# Altium project BiDirectional-Charger-INVERTER-Hardware.PrjPcb
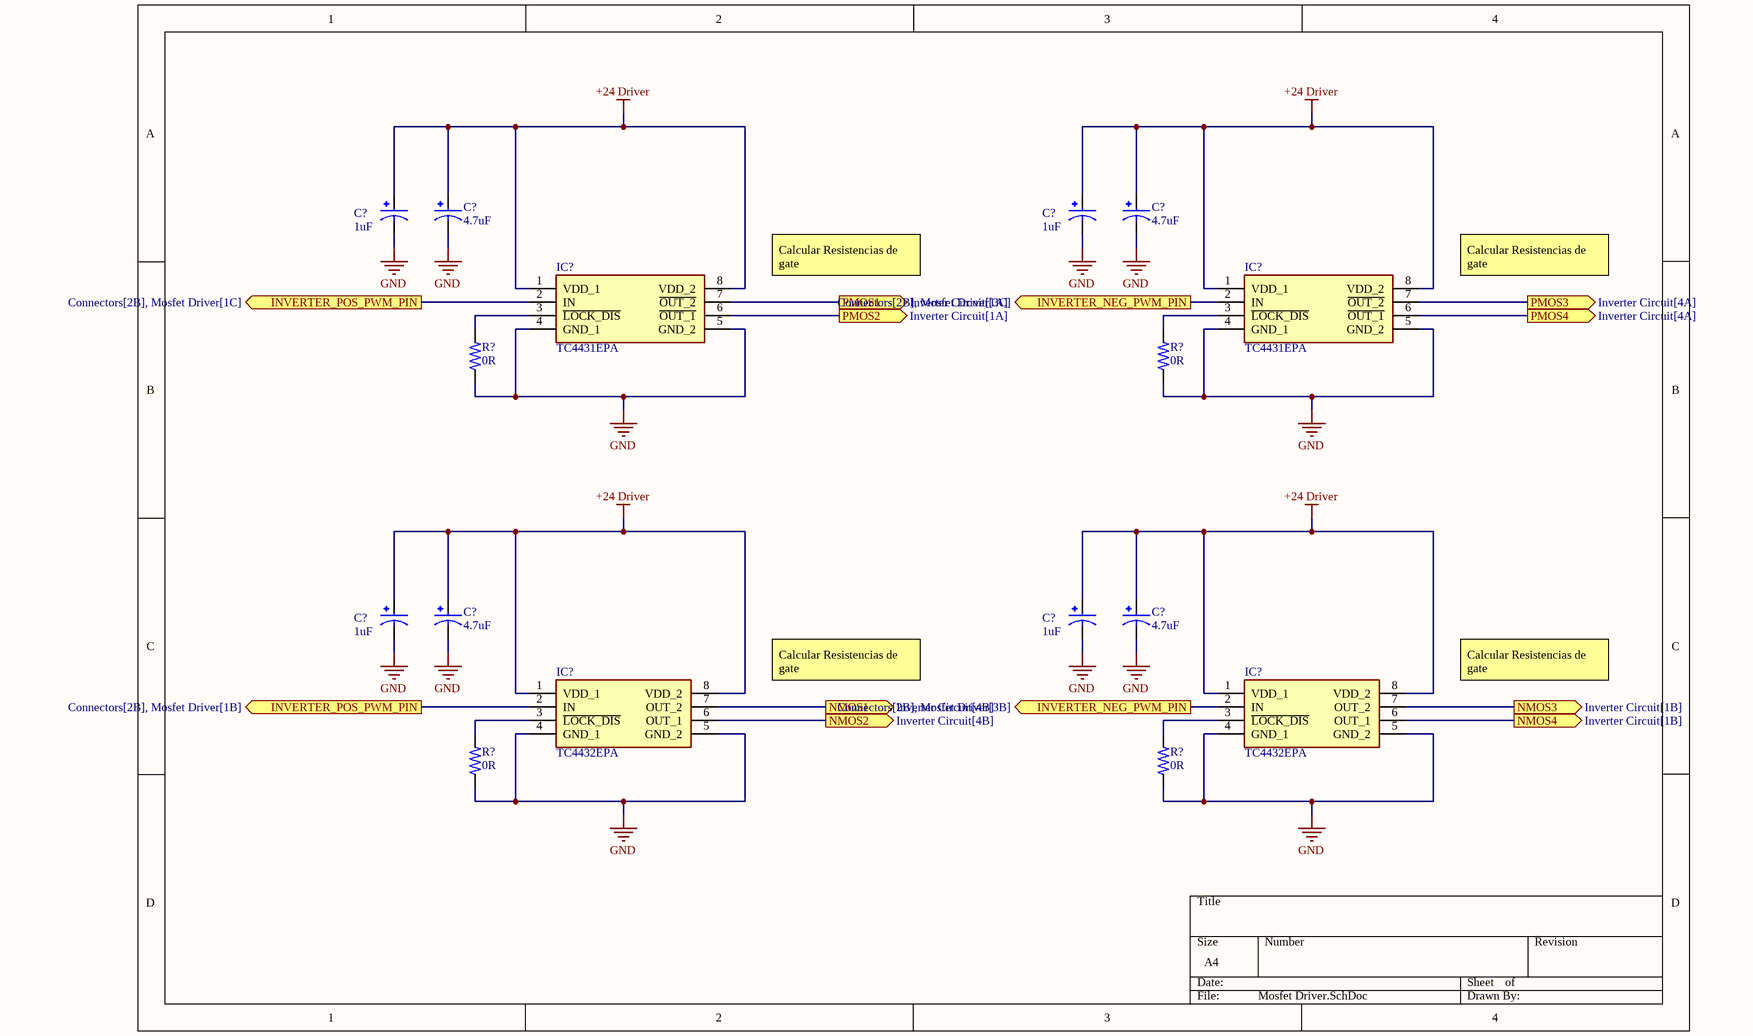
[diagram p0: Mosfet Driver.SchDoc]
4 sheets, 53 parts. Net scope: flat (ports and power ports of the same name join across sheets).
Sheets:
  Mosfet Driver.SchDoc
  Inverter Circuit.SchDoc
  Zero Cross Circuit.SchDoc
  Connectors.SchDoc

## Sheet Mosfet Driver.SchDoc
size A4; SheetNumber: 1; SheetTotal: 3

### Parts
(Parts that share a designator on the sheet are numbered #1, #2 ... from top to bottom, then left to right.)
C?#1  1uF  [Electrolytic 4x5.4]
C?#2  4.7uF  [Electrolytic 4x5.4]
C?#3  1uF  [Electrolytic 4x5.4]
C?#4  4.7uF  [Electrolytic 4x5.4]
C?#5  1uF  [Electrolytic 4x5.4]
C?#6  4.7uF  [Electrolytic 4x5.4]
C?#7  1uF  [Electrolytic 4x5.4]
C?#8  4.7uF  [Electrolytic 4x5.4]
IC?#1  TC4431EPA  [DIP781W56P254L950H533Q8N]
IC?#2  TC4431EPA  [DIP781W56P254L950H533Q8N]
IC?#3  TC4432EPA  [DIP781W56P254L950H533Q8N]
IC?#4  TC4432EPA  [DIP781W56P254L950H533Q8N]
R?#1  0R  [0805]
R?#2  0R  [0805]
R?#3  0R  [0805]
R?#4  0R  [0805]

### Ports
INVERTER_NEG_PWM_PIN (out, see Connectors[2B], Mosfet Driver[3B]), INVERTER_NEG_PWM_PIN (out, see Connectors[2B], Mosfet Driver[3C]), INVERTER_POS_PWM_PIN (out, see Connectors[2B], Mosfet Driver[1B]), INVERTER_POS_PWM_PIN (out, see Connectors[2B], Mosfet Driver[1C]), NMOS1 (out, see Inverter Circuit[4B]), NMOS2 (out, see Inverter Circuit[4B]), NMOS3 (out, see Inverter Circuit[1B]), NMOS4 (out, see Inverter Circuit[1B]), PMOS1 (out, see Inverter Circuit[1A]), PMOS2 (out, see Inverter Circuit[1A]), PMOS3 (out, see Inverter Circuit[4A]), PMOS4 (out, see Inverter Circuit[4A])

### Nets
+24 Driver: C?#1.1 C?#2.1 C?#3.1 C?#4.1 C?#5.1 C?#6.1 C?#7.1 C?#8.1 IC?#1.1(VDD_1) IC?#1.8(VDD_2) IC?#2.1(VDD_1) IC?#2.8(VDD_2) IC?#3.1(VDD_1) IC?#3.8(VDD_2) IC?#4.1(VDD_1) IC?#4.8(VDD_2)
GND: C?#1.2 C?#2.2 C?#3.2 C?#4.2 C?#5.2 C?#6.2 C?#7.2 C?#8.2 IC?#1.4(GND_1) IC?#1.5(GND_2) IC?#2.4(GND_1) IC?#2.5(GND_2) IC?#3.4(GND_1) IC?#3.5(GND_2) IC?#4.4(GND_1) IC?#4.5(GND_2) R?#1.1 R?#2.1 R?#3.1 R?#4.1
NetIC?#1_2: IC?#1.2(IN) IC?#3.2(IN) ; port INVERTER_POS_PWM_PIN
NetIC?#1_3: IC?#1.3(~{LOCK_DIS}) R?#1.2
NetIC?#1_6: IC?#1.6(~{OUT_1}) ; port PMOS2
NetIC?#1_7: IC?#1.7(~{OUT_2}) ; port PMOS1
NetIC?#2_2: IC?#2.2(IN) IC?#4.2(IN) ; port INVERTER_NEG_PWM_PIN
NetIC?#2_3: IC?#2.3(~{LOCK_DIS}) R?#2.2
NetIC?#2_6: IC?#2.6(~{OUT_1}) ; port PMOS4
NetIC?#2_7: IC?#2.7(~{OUT_2}) ; port PMOS3
NetIC?#3_3: IC?#3.3(~{LOCK_DIS}) R?#3.2
NetIC?#3_6: IC?#3.6(OUT_1) ; port NMOS2
NetIC?#3_7: IC?#3.7(OUT_2) ; port NMOS1
NetIC?#4_3: IC?#4.3(~{LOCK_DIS}) R?#4.2
NetIC?#4_6: IC?#4.6(OUT_1) ; port NMOS4
NetIC?#4_7: IC?#4.7(OUT_2) ; port NMOS3

### Notes on the sheet
- Calcular Resistencias de gate

### Library data of the parts
C?#1-C?#8 = Electrolytic 4x5.4: MF: Panasonic; MP: EEE-HA1E100WR; Package: RADIAL-2 Panasonic; Check_prices: https://www.snapeda.com/parts/EEE-HA1E100WR/Panasonic/view-part/778519/?ref=eda; Value: *; Price: None; Purchase-URL: https://pricing.snapeda.com/search/part/EEE-HA1E100WR/?ref=eda; SnapEDA_Link: https://www.snapeda.com/parts/EEE-HA1E100WR/Panasonic/view-part/778519/?ref=snap; Availability: In Stock
IC?#1 IC?#2 = TC4431EPA: Integrated Circuit; Manufacturer_Name: Microchip; Datasheet Link: http://www.microchip.com/mymicrochip/filehandler.aspx?ddocname=en011707; Height: 5.334mm; Manufacturer_Part_Number: TC4431EPA; Mouser Part Number: 579-TC4431EPA; Mouser Price/Stock: https://www.mouser.co.uk/ProductDetail/Microchip-Technology/TC4431EPA?qs=6NittM2kKvToa0NDydYeNA%3D%3D; Arrow Part Number: TC4431EPA; Arrow Price/Stock: https://www.arrow.com/en/products/tc4431epa/microchip-technology
IC?#3 IC?#4 = TC4432EPA: Integrated Circuit; Manufacturer_Name: Microchip; Datasheet Link: http://ww1.microchip.com/downloads/en/DeviceDoc/21424d.pdf; Height: 5.334mm; Manufacturer_Part_Number: TC4432EPA; Mouser Part Number: 579-TC4432EPA; Mouser Price/Stock: https://www.mouser.co.uk/ProductDetail/Microchip-Technology-Atmel/TC4432EPA?qs=EkZBwCRGcSv79fL5L3lP6g%3D%3D; Arrow Part Number: TC4432EPA; Arrow Price/Stock: https://www.arrow.com/en/products/tc4432epa/microchip-technology
R?#1-R?#4 = 0805_Resistor: Power_Rating: .25 W; MP: 2-2176053-0; Tolerance: 1%; Resistance: .33; MF: TE Connectivity; Price: None; Availability: In Stock; EU_RoHS_Compliance: Compliant with Exemptions; Package: 0805; Value: *; SnapEDA_Link: https://www.snapeda.com/parts/2-2176053-0/TE+Connectivity/view-part/?ref=snap; Check_prices: https://www.snapeda.com/parts/2-2176053-0/TE+Connectivity/view-part/?ref=eda

## Sheet Inverter Circuit.SchDoc
size A4; SheetNumber: 2; SheetTotal: 3
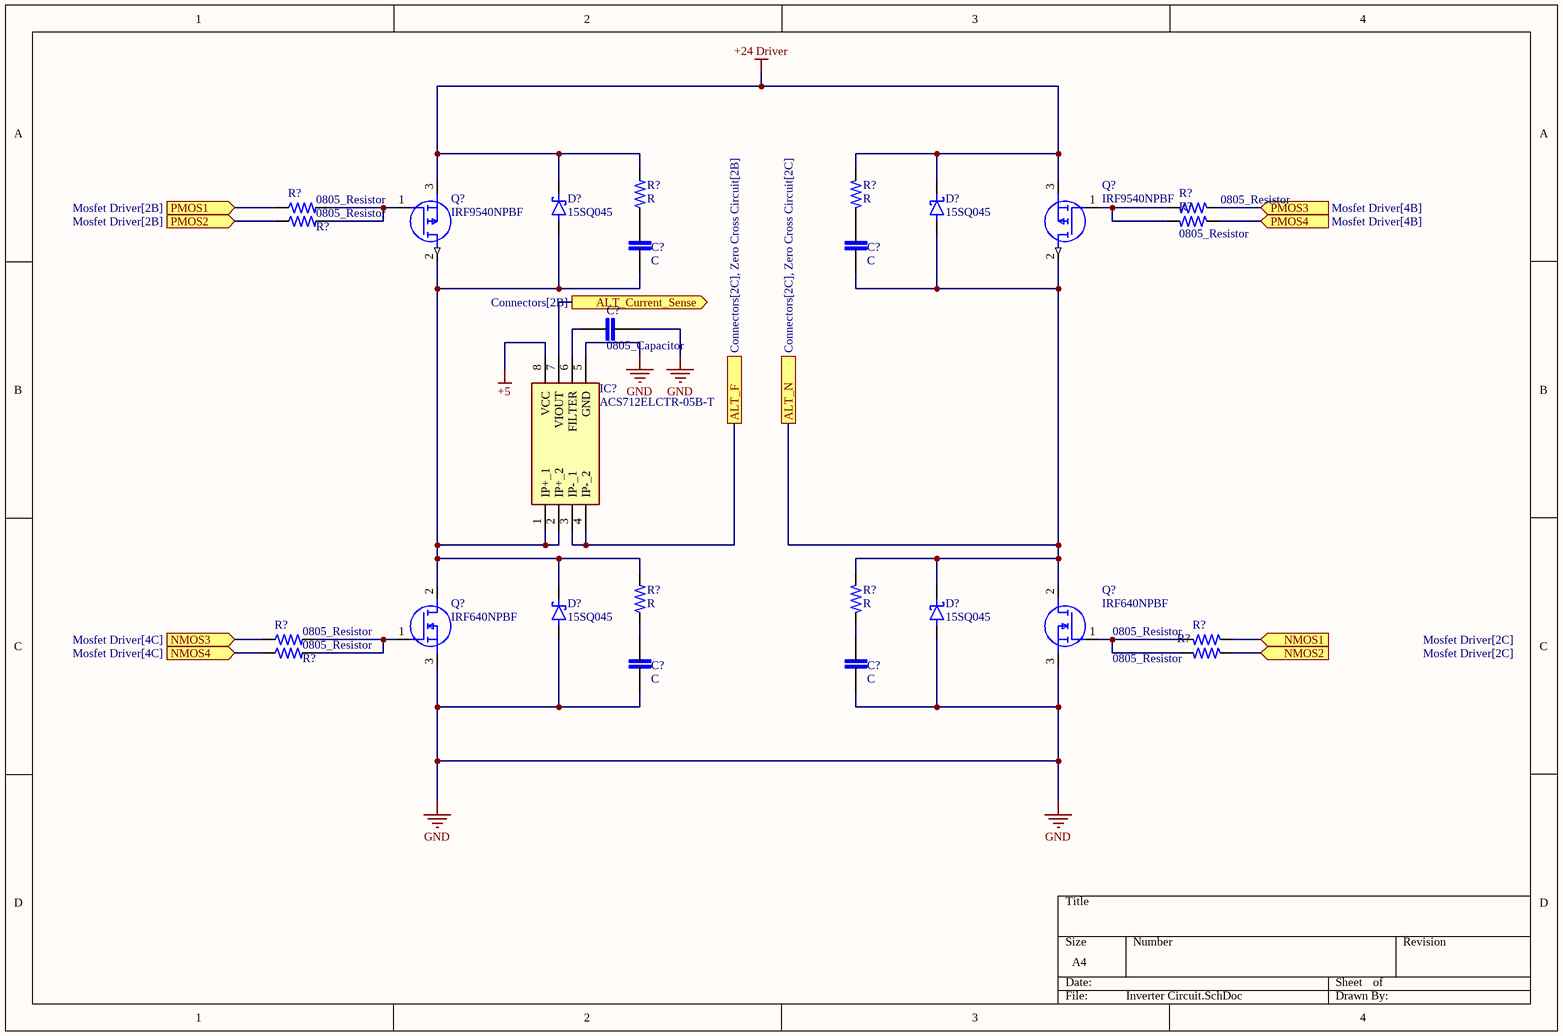
[diagram p1: Inverter Circuit.SchDoc]

### Parts
(Parts that share a designator on the sheet are numbered #1, #2 ... from top to bottom, then left to right.)
C?#9  C  [0805]
C?#10  C  [0805]
C?#11  0805_Capacitor  [0805]
C?#12  C  [0805]
C?#13  C  [0805]
D?#1  15SQ045  [Common Trhough Hole]
D?#2  15SQ045  [Common Trhough Hole]
D?#3  15SQ045  [Common Trhough Hole]
D?#4  15SQ045  [Common Trhough Hole]
IC?#5  ACS712ELCTR-05B-T  [SOIC127P600X175-8N]
Q?#1  IRF9540NPBF  [TO254P469X1042X1967-3P]
Q?#2  IRF9540NPBF  [TO254P469X1042X1967-3P]
Q?#3  IRF640NPBF  [TO254P483X1016X1994-3P]
Q?#4  IRF640NPBF  [TO254P483X1016X1994-3P]
R?#5  R  [0805]
R?#6  R  [0805]
R?#7  0805_Resistor  [0805]
R?#8  0805_Resistor  [0805]
R?#9  0805_Resistor  [0805]
R?#10  0805_Resistor  [0805]
R?#11  R  [0805]
R?#12  R  [0805]
R?#13  0805_Resistor  [0805]
R?#14  0805_Resistor  [0805]
R?#15  0805_Resistor  [0805]
R?#16  0805_Resistor  [0805]

### Ports
ALT_Current_Sense (out, see Connectors[2B]), ALT_F (see Connectors[2C], Zero Cross Circuit[2B]), ALT_N (see Connectors[2C], Zero Cross Circuit[2C]), NMOS1 (in, see Mosfet Driver[2C]), NMOS2 (in, see Mosfet Driver[2C]), NMOS3 (in, see Mosfet Driver[4C]), NMOS4 (in, see Mosfet Driver[4C]), PMOS1 (in, see Mosfet Driver[2B]), PMOS2 (in, see Mosfet Driver[2B]), PMOS3 (in, see Mosfet Driver[4B]), PMOS4 (in, see Mosfet Driver[4B])

### Nets
+5: IC?#5.8(VCC)
+24 Driver: D?#1.1(K) D?#2.1(K) Q?#1.3(S) Q?#2.3(S) R?#5.2 R?#6.2
GND: C?#11.2 C?#12.2 C?#13.2 D?#3.2(A) D?#4.2(A) IC?#5.5(GND) Q?#3.3(S) Q?#4.3(S)
NetC?#9_2: C?#9.2 D?#1.2(A) D?#3.1(K) IC?#5.1(IP+_1) IC?#5.2(IP+_2) Q?#1.2(D) Q?#3.2(D) R?#11.2
NetC?#10_2: C?#10.2 D?#2.2(A) D?#4.1(K) Q?#2.2(D) Q?#4.2(D) R?#12.2 ; port ALT_N
NetC?#11_1: C?#11.1 IC?#5.6(FILTER)
NetC?#12_1: C?#12.1 R?#11.1
NetC?#13_1: C?#13.1 R?#12.1
NetD?#5_2: IC?#5.3(IP-_1) IC?#5.4(IP-_2) ; port ALT_F
NetIC?#1_6: R?#9.1 ; port PMOS2
NetIC?#1_7: R?#7.1 ; port PMOS1
NetIC?#2_6: R?#10.1 ; port PMOS4
NetIC?#2_7: R?#8.1 ; port PMOS3
NetIC?#3_6: R?#16.1 ; port NMOS2
NetIC?#3_7: R?#14.1 ; port NMOS1
NetIC?#4_6: R?#15.1 ; port NMOS4
NetIC?#4_7: R?#13.1 ; port NMOS3
NetIC?#5_7: IC?#5.7(VIOUT) ; port ALT_Current_Sense
NetQ?#1_1: Q?#1.1(G) R?#7.2 R?#9.2
NetQ?#2_1: Q?#2.1(G) R?#8.2 R?#10.2
NetQ?#3_1: Q?#3.1(G) R?#13.2 R?#15.2
NetQ?#4_1: Q?#4.1(G) R?#14.2 R?#16.2

Not connected (* = marked no-connect by the designer): C?#9 1; C?#10 1; R?#5 1; R?#6 1

### Library data of the parts
C?#9-C?#13 = 0805_Capacitor: MP: LD051A121KAB2A; MF: AVX; SnapEDA_Link: https://www.snapeda.com/parts/LD051A121KAB2A/AVX/view-part/?ref=snap; Package: 0805 AVX; Check_prices: https://www.snapeda.com/parts/LD051A121KAB2A/AVX/view-part/?ref=eda; Purchase-URL: https://pricing.snapeda.com/search/part/LD051A121KAB2A/?ref=eda; Price: None; Value: *; Availability: In Stock
D?#1-D?#4 = Schottky Diode: MF: Diodes Inc.; MP: 1N5817-T; Package: DO-41 Diodes Inc.; Price: None; Check_prices: https://www.snapeda.com/parts/1N5817-T/Diodes+Inc./view-part/?ref=eda; Value: *; SnapEDA_Link: https://www.snapeda.com/parts/1N5817-T/Diodes+Inc./view-part/?ref=snap; Availability: In Stock; Purchase-URL: https://pricing.snapeda.com/search/part/1N5817-T/?ref=eda
IC?#5 = ACS712ELCTR-05B-T: Integrated Circuit; Manufacturer_Name: Sharp Microelectronics; Datasheet Link: https://www.allegromicro.com/~/media/Files/Datasheets/ACS712-Datasheet.ashx; Height: 1.75mm; Manufacturer_Part_Number: ACS712ELCTR-05B-T
Q?#1 Q?#2 = IRF9540NPBF: MOSFET (P-Channel); Manufacturer_Name: Infineon; Datasheet Link: https://www.infineon.com/dgdl/irf9540npbf.pdf?fileId=5546d462533600a401535611cfa21dc8; Height: 4.69mm; Manufacturer_Part_Number: IRF9540NPBF; Mouser Part Number: 942-IRF9540NPBF; Mouser Price/Stock: https://www.mouser.co.uk/ProductDetail/Infineon-Technologies/IRF9540NPBF?qs=9%252BKlkBgLFf0vnuA8mxUPtw%3D%3D; Arrow Part Number: IRF9540NPBF; Arrow Price/Stock: https://www.arrow.com/en/products/irf9540npbf/infineon-technologies-ag?region=europe
Q?#3 Q?#4 = IRF640NPBF: MOSFET (N-Channel); Manufacturer_Name: Infineon; Datasheet Link: https://www.infineon.com/dgdl/Infineon-IRF640N-DataSheet-v01_01-EN.pdf?fileId=5546d462533600a4015355e7be9019ee; Height: 4.83mm; Manufacturer_Part_Number: IRF640NPBF; Mouser Part Number: 942-IRF640NPBF; Mouser Price/Stock: https://www.mouser.co.uk/ProductDetail/Infineon-Technologies/IRF640NPBF?qs=9%252BKlkBgLFf3E8kFH1ru13w%3D%3D; Arrow Part Number: IRF640NPBF; Arrow Price/Stock: https://www.arrow.com/en/products/irf640npbf/infineon-technologies-ag?region=europe
R?#5-R?#16 = 0805_Resistor: as R?#1 on sheet Mosfet Driver; Price: None; Availability: In Stock; EU_RoHS_Compliance: Compliant with Exemptions; Package: 0805; Value: *; SnapEDA_Link: https://www.snapeda.com/parts/2-2176053-0/TE+Connectivity/view-part/?ref=snap; Check_prices: https://www.snapeda.com/parts/2-2176053-0/TE+Connectivity/view-part/?ref=eda

## Sheet Zero Cross Circuit.SchDoc
size A4; SheetNumber: 4; SheetTotal: 4
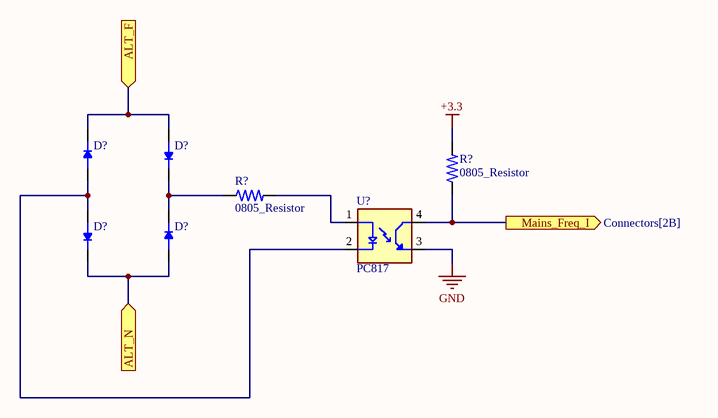
[diagram p2: Zero Cross Circuit.SchDoc]

### Parts
(Parts that share a designator on the sheet are numbered #1, #2 ... from top to bottom, then left to right.)
D?#5  SOD123 - Rectifier Diode  [SOD123]  (value not drawn)
D?#6  SOD123 - Rectifier Diode  [SOD123]  (value not drawn)
D?#7  SOD123 - Rectifier Diode  [SOD123]  (value not drawn)
D?#8  SOD123 - Rectifier Diode  [SOD123]  (value not drawn)
R?#17  0805_Resistor  [0805]
R?#18  0805_Resistor  [0805]
U?  PC817  [PC817]

### Ports
ALT_F (in), ALT_N (in), Mains_Freq_I (out, see Connectors[2B])

### Nets
+3.3: R?#17.2
GND: U?.3(ET)
NetC?#10_2: D?#7.2(A) D?#8.1(K) ; port ALT_N
NetD?#5_1: D?#5.1(K) D?#7.1(K) U?.2(C)
NetD?#5_2: D?#5.2(A) D?#6.1(K) ; port ALT_F
NetD?#6_2: D?#6.2(A) D?#8.2(A) R?#18.1
NetJ?#1_1: R?#17.1 U?.4(CT) ; port Mains_Freq_I
NetR?#18_2: R?#18.2 U?.1(A)

### Library data of the parts
D?#5-D?#8 = SOD123 - Rectifier Diode: MF: Diodes Inc.; MP: 1N4148W-7-F; Value: *; Availability: In Stock; Package: SOD-123 Fairchild Semiconductor; SnapEDA_Link: https://www.snapeda.com/parts/1N4148W-7-F/Diodes+Inc./view-part/?ref=snap; Price: None; Check_prices: https://www.snapeda.com/parts/1N4148W-7-F/Diodes+Inc./view-part/?ref=eda; Purchase-URL: https://pricing.snapeda.com/search/part/1N4148W-7-F/?ref=eda
R?#17 R?#18 = 0805_Resistor: as R?#1 on sheet Mosfet Driver; Price: None; Availability: In Stock; EU_RoHS_Compliance: Compliant with Exemptions; Package: 0805; Value: *; SnapEDA_Link: https://www.snapeda.com/parts/2-2176053-0/TE+Connectivity/view-part/?ref=snap; Check_prices: https://www.snapeda.com/parts/2-2176053-0/TE+Connectivity/view-part/?ref=eda
U? = PC817: Optoisolator Transistor Output 5000Vrms 1 Channel 4-SMD; MP: PC817XI; MF: Sharp Microelectronics; Price: None; Availability: In Stock; Package: SMD-4 Sharp Microelectronics; Value: *; SnapEDA_Link: https://www.snapeda.com/parts/PC817XI/Sharp+Microelectronics/view-part/?ref=snap; Purchase-URL: https://pricing.snapeda.com/search/part/PC817XI/?ref=eda; Check_prices: https://www.snapeda.com/parts/PC817XI/Sharp+Microelectronics/view-part/?ref=eda

## Sheet Connectors.SchDoc
size A4; SheetNumber: 4; SheetTotal: 3
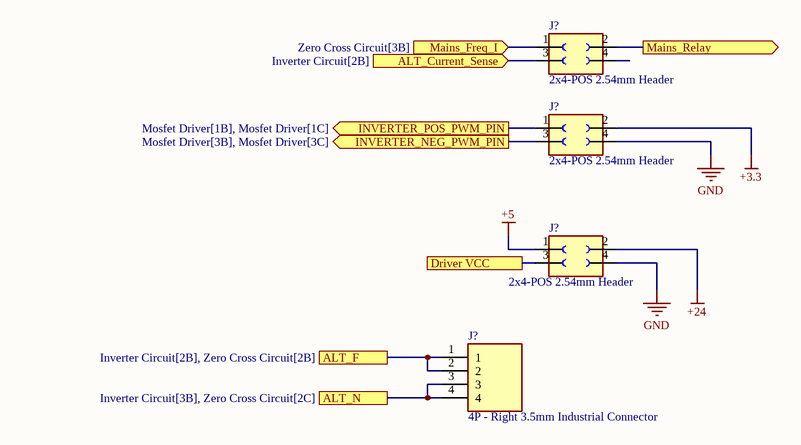
[diagram p3: Connectors.SchDoc]

### Parts
(Parts that share a designator on the sheet are numbered #1, #2 ... from top to bottom, then left to right.)
J?#1  2x4-POS 2.54mm Header  [2x4-POS 2.54mm Header]
J?#2  2x4-POS 2.54mm Header  [2x4-POS 2.54mm Header]
J?#3  2x4-POS 2.54mm Header  [2x4-POS 2.54mm Header]
J?#4  4P - Right 3.5mm Industrial Connector  [4P - Right 3.5mm Industrial Connector]

### Ports
ALT_Current_Sense (in, see Inverter Circuit[2B]), ALT_F (see Inverter Circuit[2B], Zero Cross Circuit[2B]), ALT_N (see Inverter Circuit[3B], Zero Cross Circuit[2C]), Driver VCC, INVERTER_NEG_PWM_PIN (out, see Mosfet Driver[3B], Mosfet Driver[3C]), INVERTER_POS_PWM_PIN (out, see Mosfet Driver[1B], Mosfet Driver[1C]), Mains_Freq_I (in, see Zero Cross Circuit[3B]), Mains_Relay (out)

### Nets
+3.3: J?#2.2
+5: J?#3.1
+24: J?#3.2
GND: J?#2.4 J?#3.4
NetC?#10_2: J?#4.3 J?#4.4 ; port ALT_N
NetD?#5_2: J?#4.1 J?#4.2 ; port ALT_F
NetIC?#1_2: J?#2.1 ; port INVERTER_POS_PWM_PIN
NetIC?#2_2: J?#2.3 ; port INVERTER_NEG_PWM_PIN
NetIC?#5_7: J?#1.3 ; port ALT_Current_Sense
NetJ?#1_1: J?#1.1 ; port Mains_Freq_I
NetJ?#1_2: J?#1.2 ; port Mains_Relay
NetJ?#3_3: J?#3.3 ; port Driver VCC

Not connected (* = marked no-connect by the designer): J?#1 4(3)

### Library data of the parts
J?#1-J?#3 = 2x4-POS 2.54mm Header: Female header [WÃ¼rth Elektronik] 613004243121 Female header; SnapEDA_Link: https://www.snapeda.com/parts/613004243121/W%C3%BCrth%20Elektronik/view-part/1737074/?ref=snap; Check_prices: https://www.snapeda.com/parts/613004243121/W%C3%BCrth%20Elektronik/view-part/1737074/?ref=eda; Availability: Unavailable; Value: *; MF: WÃ¼rth Elektronik; Price: None; MP: 613004243121; Package: None
J?#4 = 4P - Right 3.5mm Industrial Connector: MP: 5-146290-4; Package: None; Price: None; Value: *; Availability: Unavailable

## Nets that join several sheets
+3.3: Zero Cross Circuit (R?#17.2), Connectors (J?#2.2)
+5: Inverter Circuit (IC?#5.8), Connectors (J?#3.1)
+24 Driver: Mosfet Driver (16 pins), Inverter Circuit (6 pins)
GND: Mosfet Driver (20 pins), Inverter Circuit (8 pins), Zero Cross Circuit (U?.3), Connectors (J?#2.4 J?#3.4)
NetC?#10_2: Inverter Circuit (6 pins), Zero Cross Circuit (D?#7.2 D?#8.1), Connectors (J?#4.3 J?#4.4)
NetD?#5_2: Inverter Circuit (IC?#5.3 IC?#5.4), Zero Cross Circuit (D?#5.2 D?#6.1), Connectors (J?#4.1 J?#4.2)
NetIC?#1_2: Mosfet Driver (IC?#1.2 IC?#3.2), Connectors (J?#2.1)
NetIC?#1_6: Mosfet Driver (IC?#1.6), Inverter Circuit (R?#9.1)
NetIC?#1_7: Mosfet Driver (IC?#1.7), Inverter Circuit (R?#7.1)
NetIC?#2_2: Mosfet Driver (IC?#2.2 IC?#4.2), Connectors (J?#2.3)
NetIC?#2_6: Mosfet Driver (IC?#2.6), Inverter Circuit (R?#10.1)
NetIC?#2_7: Mosfet Driver (IC?#2.7), Inverter Circuit (R?#8.1)
NetIC?#3_6: Mosfet Driver (IC?#3.6), Inverter Circuit (R?#16.1)
NetIC?#3_7: Mosfet Driver (IC?#3.7), Inverter Circuit (R?#14.1)
NetIC?#4_6: Mosfet Driver (IC?#4.6), Inverter Circuit (R?#15.1)
NetIC?#4_7: Mosfet Driver (IC?#4.7), Inverter Circuit (R?#13.1)
NetIC?#5_7: Inverter Circuit (IC?#5.7), Connectors (J?#1.3)
NetJ?#1_1: Zero Cross Circuit (R?#17.1 U?.4), Connectors (J?#1.1)